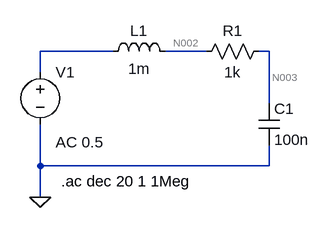
[diagram p0: schematic aufgabe3_RLC.asc]
aufgabe3_RLC.asc, the LTspice schematic file:
Version 4
SHEET 1 880 680
WIRE 144 80 32 80
WIRE 288 80 224 80
WIRE 384 80 368 80
WIRE 32 112 32 80
WIRE 384 160 384 80
WIRE 32 256 32 192
WIRE 384 256 384 224
WIRE 384 256 32 256
WIRE 32 304 32 256
FLAG 32 304 0
SYMBOL voltage 32 96 R0
WINDOW 123 24 124 Left 2
WINDOW 39 0 0 Left 2
SYMATTR InstName V1
SYMATTR Value ""
SYMATTR Value2 AC 0.5
SYMBOL ind 128 96 R270
WINDOW 0 32 56 VTop 2
WINDOW 3 5 56 VBottom 2
SYMATTR InstName L1
SYMATTR Value 1m
SYMBOL res 384 64 R90
WINDOW 0 0 56 VBottom 2
WINDOW 3 32 56 VTop 2
SYMATTR InstName R1
SYMATTR Value 1k
SYMBOL cap 368 160 R0
SYMATTR InstName C1
SYMATTR Value 100n
TEXT 64 280 Left 2 !.ac dec 20 1 1Meg

The netlist it stands for:
* aufgabe3_RLC.asc
V1 N001 0 AC 0.5
L1 N001 N002 1m
R1 N003 N002 1k
C1 N003 0 100n
.ac dec 20 1 1Meg
.backanno
.end

* Results of the author's LTspice run, read from the files saved beside the schematic
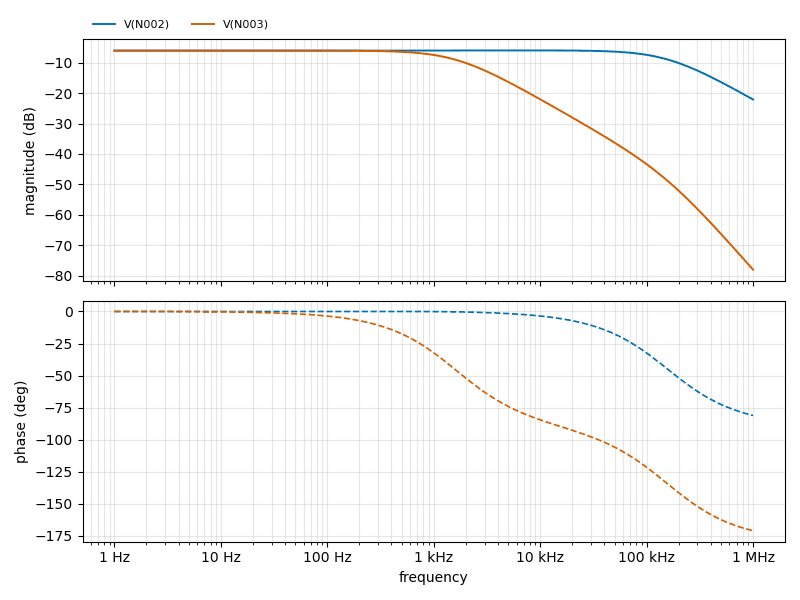
[diagram p1: AC Analysis of aufgabe3_RLC.asc, plotted from the saved traces]
* AC Analysis, 1 run:
*   V(N002): -6.02 dB at 1 Hz, -22.09 dB at 1 MHz, peak -5.94 dB at 5.623 kHz, 3 dB below the peak at 158 kHz
*   V(N003): -6.02 dB at 1 Hz, -78.05 dB at 1 MHz, peak -6.02 dB at 1 Hz, 3 dB below the peak at 1.607 kHz